# Altium schematic sheet MPU.SchDoc
size A4; SheetNumber: 2; SheetTotal: 3
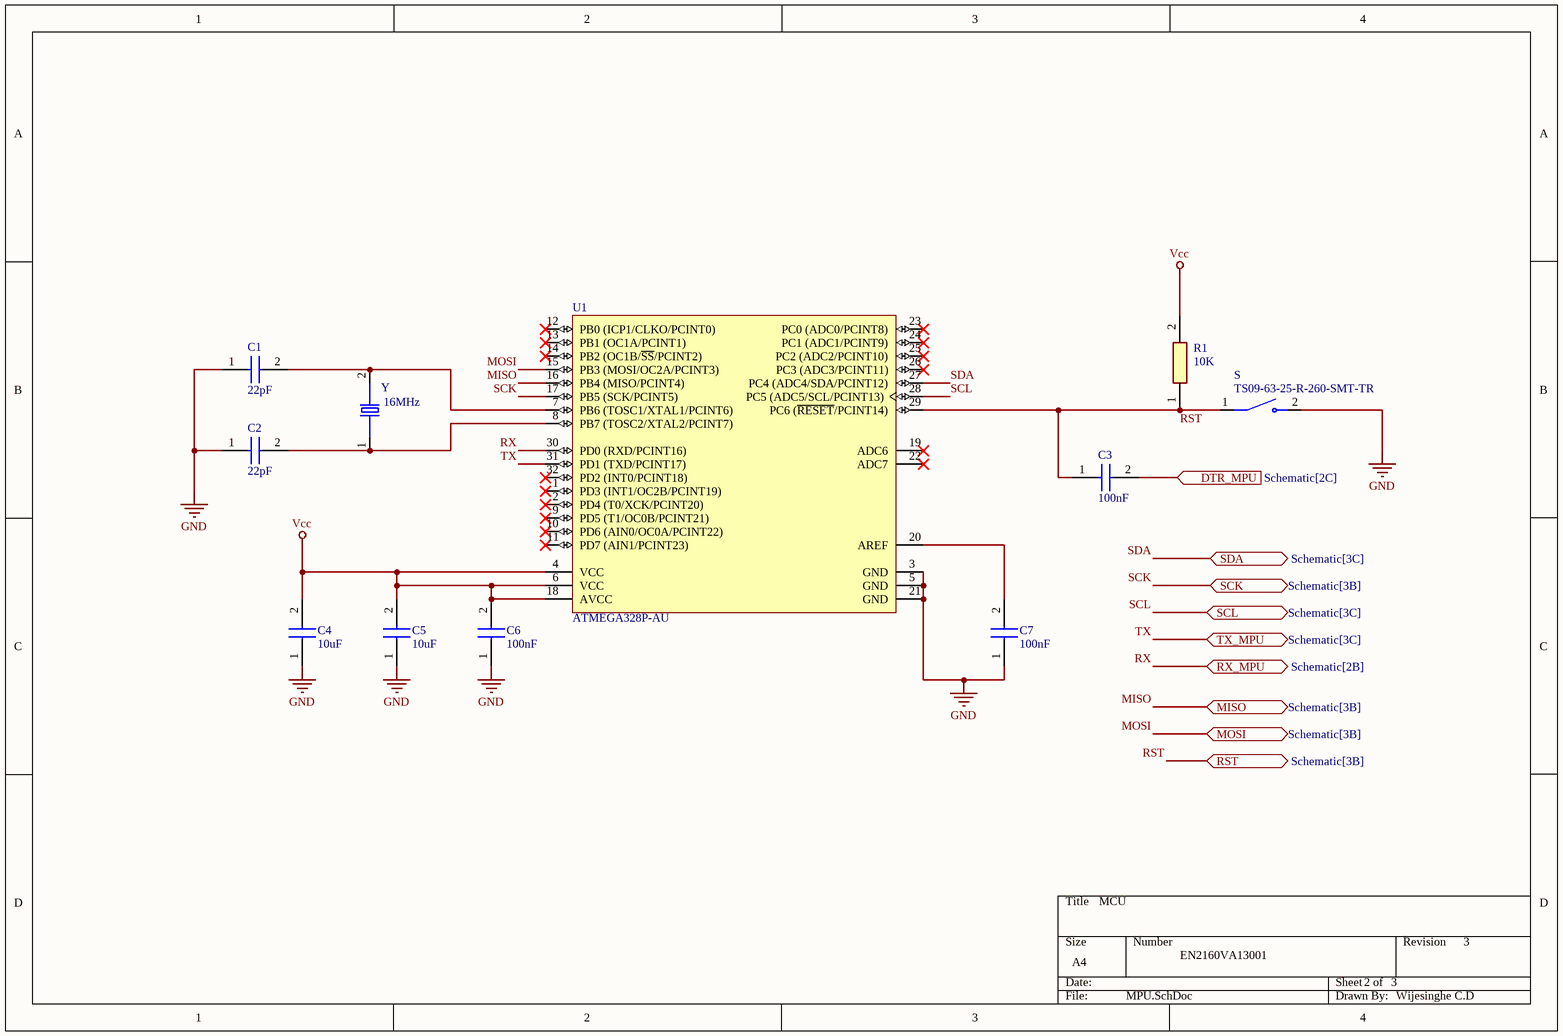
[diagram p0: MPU.SchDoc]

## Parts
C1  22pF  [C0805]
C2  22pF  [C0805]
C3  100nF  [CAPC2013X137N]
C4  10uF  [CAPC2012X145N]
C5  10uF  [CAPC2012X145N]
C6  100nF  [CAPC2013X137N]
C7  100nF  [CAPC2013X137N]
R1  10K  [RESC2013X65N]
S  TS09-63-25-R-260-SMT-TR  [SW_TS09-63-25-R-260-SMT-TR]
U1  ATMEGA328P-AU  [ATML-32A_M]
Y  16MHz  [XTAL_FOXSDLF/160-20]

## Ports
DTR_MPU (in, see Schematic[2C]), MISO (bidir, see Schematic[3B]), MOSI (bidir, see Schematic[3B]), RST (bidir, see Schematic[3B]), RX_MPU (bidir, see Schematic[2B]), SCK (bidir, see Schematic[3B]), SCL (bidir, see Schematic[3C]), SDA (bidir, see Schematic[3C]), TX_MPU (bidir, see Schematic[3C])

## Nets
GND: C1.1 C2.1 C4.1 C5.1 C6.1 C7.1 S.2 U1.3(GND) U1.5(GND) U1.21(GND)
Vcc: C4.2 C5.2 C6.2 R1.2 U1.4(VCC) U1.6(VCC) U1.18(AVCC)
DTR_MPU: C3.2 ; port DTR_MPU
MISO: U1.16(PB4_(MISO/PCINT4)) ; port MISO
MOSI: U1.15(PB3_(MOSI/OC2A/PCINT3)) ; port MOSI
RST: C3.1 R1.1 S.1 U1.29(PC6_(~{RESET}/PCINT14)) ; port RST
RX: U1.30(PD0_(RXD/PCINT16)) ; port RX_MPU
SCK: U1.17(PB5_(SCK/PCINT5)) ; port SCK
SCL: U1.28(PC5_(ADC5/SCL/PCINT13)) ; port SCL
SDA: U1.27(PC4_(ADC4/SDA/PCINT12)) ; port SDA
TX: U1.31(PD1_(TXD/PCINT17)) ; port TX_MPU
NetC1_2: C1.2 U1.7(PB6_(TOSC1/XTAL1/PCINT6)) Y.2
NetC2_2: C2.2 U1.8(PB7_(TOSC2/XTAL2/PCINT7)) Y.1
NetC7_2: C7.2 U1.20(AREF)

Not connected (* = marked no-connect by the designer): U1 1(PD3_(INT1/OC2B/PCINT19))* 2(PD4_(T0/XCK/PCINT20))* 9(PD5_(T1/OC0B/PCINT21))* 10(PD6_(AIN0/OC0A/PCINT22))* 11(PD7_(AIN1/PCINT23))* 12(PB0_(ICP1/CLKO/PCINT0))* 13(PB1_(OC1A/PCINT1))* 14(PB2_(OC1B/~{SS}/PCINT2))* 19(ADC6)* 22(ADC7)* 23(PC0_(ADC0/PCINT8))* 24(PC1_(ADC1/PCINT9))* 25(PC2_(ADC2/PCINT10))* 26(PC3_(ADC3/PCINT11))* 32(PD2_(INT0/PCINT18))*

## Notes on the sheet
- MCU
- EN2160VA13001
- 2
- 3
- Wijesinghe C.D

## Library data of the parts
C1 C2 = C0805X220J1GACTU: Capacitor; Manufacturer_Name: KEMET; Datasheet Link: https://content.kemet.com/datasheets/KEM_C1062_C0G_FT-CAP_SMD.pdf; Height: 1.1mm; Manufacturer_Part_Number: C0805X220J1GACTU; Mouser Part Number: 80-C0805X220J1GACTU; Mouser Price/Stock: https://www.mouser.co.uk/ProductDetail/KEMET/C0805X220J1GACTU?qs=ds50AKTGxA9gC%252BgDVpAXPw%3D%3D
C3 C6 C7 = 0805B104K500NT: Capacitor; Manufacturer_Name: Novacap; Datasheet Link: https://componentsearchengine.com/Datasheets/1/0805B104K500NT.pdf; Height: 1.37mm; Manufacturer_Part_Number: 0805B104K500NT; Mouser Part Number: 767-0805B104K500NT; Mouser Price/Stock: https://www.mouser.com/Search/Refine.aspx?Keyword=767-0805B104K500NT
C4 C5 = GCM21BC71E106KE36K: Capacitor; Manufacturer_Name: Murata Electronics; Datasheet Link: https://search.murata.co.jp/Ceramy/image/img/A01X/G101/ENG/GRM21BC71E106KE11-01.pdf; Height: 1.45mm; Manufacturer_Part_Number: GCM21BC71E106KE36K; Mouser Part Number: 81-GCM21B71E106KE36K; Mouser Price/Stock: https://www.mouser.co.uk/ProductDetail/Murata-Electronics/GCM21BC71E106KE36K?qs=By6Nw2ByBD3dg3yZS4KZOA%3D%3D
R1 = 0805W8F1002T5E: Resistor; Manufacturer_Name: UniOhm; Height: 0.65mm; Manufacturer_Part_Number: 0805W8F1002T5E
U1 = CMP-020-00003-3: 8-Bit Microcontroller with 32 KBytes In-System Programmable Flash, 23 I/Os, -40 to 85 degC, 32-Pin TQFP (32A), RoHS, Tray; Manufacturer: Atmel; PWM Channels: 6; Frequency: 20MHz; RAM Size: 2KB; ADC Channels: 8; Max Supply Voltage: 5.5V; Density: 32KB; USB Channels: 0; I/Os: 23; Min Supply Voltage: 1.8V; Interface: USART; Package Reference: 32A; Package Description: 32-Pin Thin Profile Plastic Quad Flat Package, Body 7 x 7 mm, Pitch 0.8 mm; Max Operating Temperature: 85°C; Mounting Technology: SM; Datasheet URL: http://www.atmel.com/images/Atmel-8271-8-bit-AVR-Microcontroller-ATmega48A-48PA-88A-88PA-168A-168PA-328-328P_datasheet_Complete.pdf; Pins: 32; Packaging: Tray; RoHS Compliant: True; Max Clock Frequency: 20MHz; Ethernet Channels: 0; Clock Frequency: 20MHz; Case/Package: TQFP; Manufacturer URL: http://www.atmel.com/; Datasheet Version: Rev. 8271J, 11/2015; Package Quantity: 250; Min Operating Temperature: -40°C
Y = FOXSDLF/160-20: Microprocessor, Crystal; 16 Mhz; + 30 Ppm @ Degc; 7 Pf (Max.); 20 Pf; -20 Deg; MF: Fox Electronics; Package: HC49SD Fox Electronics; Price: None; Value: *; SnapEDA_Link: https://www.snapeda.com/parts/FOXSDLF/160-20/Fox+Electronics/view-part/?ref=snap; MP: FOXSDLF/160-20; Availability: In Stock; Check_prices: https://www.snapeda.com/parts/FOXSDLF/160-20/Fox+Electronics/view-part/?ref=eda
S = TS09-63-25-R-260-SMT-TR: Availability: Unavailable; Price: None; Package: None; Value: *; MP: TS09-63-25-R-260-SMT-TR